# EAGLE design solenoid (EAGLE 6.6.0)
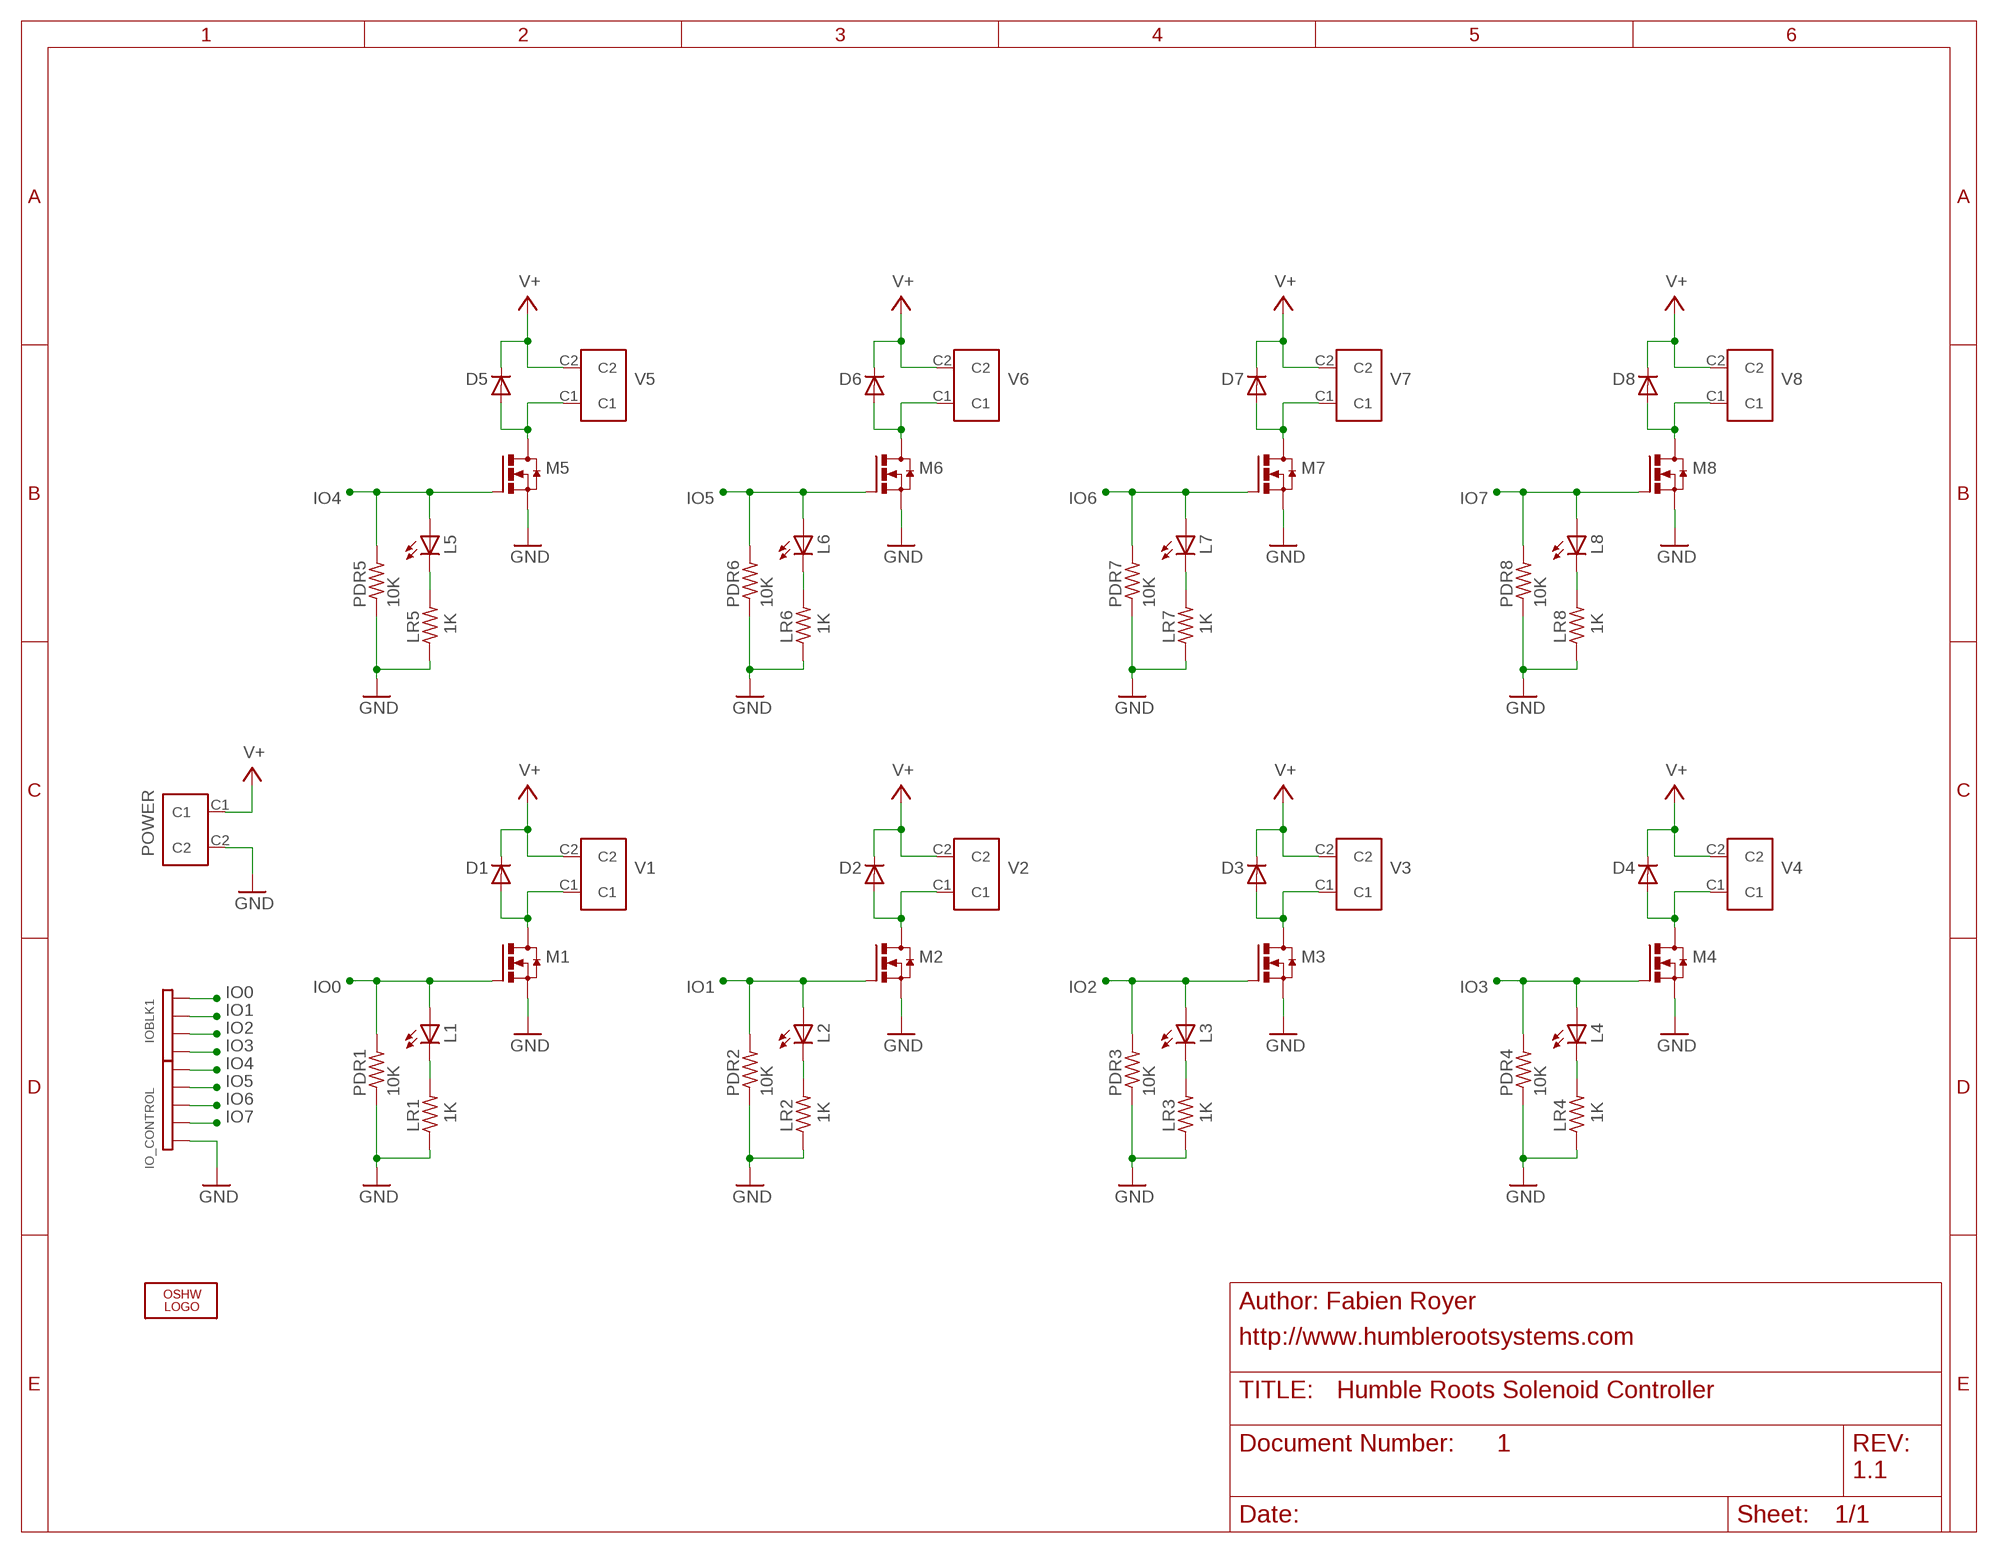
[diagram p0: schematic, sheet 1]

## Parts
D1  1N4004  [DO41-10]
D2  1N4004  [DO41-10]
D3  1N4004  [DO41-10]
D4  1N4004  [DO41-10]
D5  1N4004  [DO41-10]
D6  1N4004  [DO41-10]
D7  1N4004  [DO41-10]
D8  1N4004  [DO41-10]
IO_CONTROL  PIN_HEADER_5_POSITIONS  [PIN_HEADER_5_POSITIONS]
IOBLK1  PIN_HEADER_4_POSITIONS  [PIN_HEADER_4_POSITIONS]
L1  2v 12mA  LED3MM  [LED3MM]
L2  2v 12mA  LED3MM  [LED3MM]
L3  2v 12mA  LED3MM  [LED3MM]
L4  2v 12mA  LED3MM  [LED3MM]
L5  2v 12mA  LED3MM  [LED3MM]
L6  2v 12mA  LED3MM  [LED3MM]
L7  2v 12mA  LED3MM  [LED3MM]
L8  2v 12mA  LED3MM  [LED3MM]
LOGO1  OSHW_LOGO_6MILX0200-NT  [OSHW_6X200_NOTEXT]
LR1  1K  R-US_0207/10  [0207/10]
LR2  1K  R-US_0207/10  [0207/10]
LR3  1K  R-US_0207/10  [0207/10]
LR4  1K  R-US_0207/10  [0207/10]
LR5  1K  R-US_0207/10  [0207/10]
LR6  1K  R-US_0207/10  [0207/10]
LR7  1K  R-US_0207/10  [0207/10]
LR8  1K  R-US_0207/10  [0207/10]
M1  INTERNATIONAL_RECTIFIER_IRLB8721PBF  [TO220ABS]
M2  INTERNATIONAL_RECTIFIER_IRLB8721PBF  [TO220ABS]
M3  INTERNATIONAL_RECTIFIER_IRLB8721PBF  [TO220ABS]
M4  INTERNATIONAL_RECTIFIER_IRLB8721PBF  [TO220ABS]
M5  INTERNATIONAL_RECTIFIER_IRLB8721PBF  [TO220ABS]
M6  INTERNATIONAL_RECTIFIER_IRLB8721PBF  [TO220ABS]
M7  INTERNATIONAL_RECTIFIER_IRLB8721PBF  [TO220ABS]
M8  INTERNATIONAL_RECTIFIER_IRLB8721PBF  [TO220ABS]
PDR1  10K  R-US_0207/10  [0207/10]
PDR2  10K  R-US_0207/10  [0207/10]
PDR3  10K  R-US_0207/10  [0207/10]
PDR4  10K  R-US_0207/10  [0207/10]
PDR5  10K  R-US_0207/10  [0207/10]
PDR6  10K  R-US_0207/10  [0207/10]
PDR7  10K  R-US_0207/10  [0207/10]
PDR8  10K  R-US_0207/10  [0207/10]
POWER  PHOENIX_WIRE_CONTACT_2_POSITIONS_GENERIC  [PHOENIX_WIRE_CONTACT_2_POSITIONS_GENERIC]
V1  PHOENIX_WIRE_CONTACT_2_POSITIONS_GENERIC  [PHOENIX_WIRE_CONTACT_2_POSITIONS_GENERIC]
V2  PHOENIX_WIRE_CONTACT_2_POSITIONS_GENERIC  [PHOENIX_WIRE_CONTACT_2_POSITIONS_GENERIC]
V3  PHOENIX_WIRE_CONTACT_2_POSITIONS_GENERIC  [PHOENIX_WIRE_CONTACT_2_POSITIONS_GENERIC]
V4  PHOENIX_WIRE_CONTACT_2_POSITIONS_GENERIC  [PHOENIX_WIRE_CONTACT_2_POSITIONS_GENERIC]
V5  PHOENIX_WIRE_CONTACT_2_POSITIONS_GENERIC  [PHOENIX_WIRE_CONTACT_2_POSITIONS_GENERIC]
V6  PHOENIX_WIRE_CONTACT_2_POSITIONS_GENERIC  [PHOENIX_WIRE_CONTACT_2_POSITIONS_GENERIC]
V7  PHOENIX_WIRE_CONTACT_2_POSITIONS_GENERIC  [PHOENIX_WIRE_CONTACT_2_POSITIONS_GENERIC]
V8  PHOENIX_WIRE_CONTACT_2_POSITIONS_GENERIC  [PHOENIX_WIRE_CONTACT_2_POSITIONS_GENERIC]

## Nets
GND: IO_CONTROL.5 LR1.1 LR2.1 LR3.1 LR4.1 LR5.1 LR6.1 LR7.1 LR8.1 M1.3(SOURCE) M2.3(SOURCE) M3.3(SOURCE) M4.3(SOURCE) M5.3(SOURCE) M6.3(SOURCE) M7.3(SOURCE) M8.3(SOURCE) PDR1.1 PDR2.1 PDR3.1 PDR4.1 PDR5.1 PDR6.1 PDR7.1 PDR8.1 POWER.C2
IO0: IOBLK1.1 L1.A M1.1(GATE) PDR1.2
IO1: IOBLK1.2 L2.A M2.1(GATE) PDR2.2
IO2: IOBLK1.3 L3.A M3.1(GATE) PDR3.2
IO3: IOBLK1.4 L4.A M4.1(GATE) PDR4.2
IO4: IO_CONTROL.1 L5.A M5.1(GATE) PDR5.2
IO5: IO_CONTROL.2 L6.A M6.1(GATE) PDR6.2
IO6: IO_CONTROL.3 L7.A M7.1(GATE) PDR7.2
IO7: IO_CONTROL.4 L8.A M8.1(GATE) PDR8.2
N$1: L1.K(C) LR1.2
N$2: L2.K(C) LR2.2
N$3: D2.A M2.2(DRAIN) V2.C1
N$4: L3.K(C) LR3.2
N$5: D1.A M1.2(DRAIN) V1.C1
N$6: D3.A M3.2(DRAIN) V3.C1
N$7: L4.K(C) LR4.2
N$8: D4.A M4.2(DRAIN) V4.C1
N$9: L5.K(C) LR5.2
N$10: D5.A M5.2(DRAIN) V5.C1
N$11: L6.K(C) LR6.2
N$12: D6.A M6.2(DRAIN) V6.C1
N$13: L7.K(C) LR7.2
N$14: D7.A M7.2(DRAIN) V7.C1
N$15: L8.K(C) LR8.2
N$16: D8.A M8.2(DRAIN) V8.C1
V+: D1.C D2.C D3.C D4.C D5.C D6.C D7.C D8.C POWER.C1 V1.C2 V2.C2 V3.C2 V4.C2 V5.C2 V6.C2 V7.C2 V8.C2

## Notes on the sheet
- Author: Fabien Royer
- http://www.humblerootsystems.com
- Humble Roots Solenoid Controller
- 1
- 1.1

## Library data of the parts
D1-D8 = diode:1N4004: DIODE general purpose rectifier, 1 A
IO_CONTROL = HRS:PIN_HEADER_5_POSITIONS
IOBLK1 = HRS:PIN_HEADER_4_POSITIONS
L1-L8 = led:LED: LED OSRAM: - CHIPLED LG R971, LG N971, LY N971, LG Q971, LY Q971, LO R971, LY R971 LH N974, LH R974 LS Q976, LO Q976, LY Q976 LO Q996 - Hyper CHIPLED LW Q18S LB Q993, LB Q99A, LB R99A - SideLED LS A670, LO A670, LY A670, LG A670, LP A670 LB A673, LV A673, LT A673, LW A673 LH A674 LY A675 LS A676, LA A676, LO A676, LY A676, LW A676 LS A679, LY A679, LG A679 - Hyper Micro SIDELED® LS Y876, LA Y876, LO Y876, LY Y876 LT Y87S - SmartLED LW L88C, LW L88S LB L89C, LB L89S, LG L890 LS L89K, LO L89K, LY L89K LS L896, LA L896, LO L896, LY L896 - TOPLED LS T670, LO T670, LY T670, LG T670, LP T670 LSG T670, LSP T670, LSY T670, LOP T670, LYG T670 LG T671, LOG T671, LSG T671 LB T673, LV T673, LT T673, LW T673 LH T674 LS T676, LA T676, LO T676, LY T676, LB T676, LH T676, LSB T676, LW T676 LB T67C, LV T67C, LT T67C, LS T67K, LO T67K, LY T67K, LW E67C LS E67B, LA E67B, LO E67B, LY E67B, LB E67C, LV E67C, LT E67C LW T67C LS T679, LY T679, LG T679 LS T770, LO T770, LY T770, LG T770, LP T770 LB T773, LV T773, LT T773, LW T773 LH T774 LS E675, LA E675, LY E675, LS T675 LS T776, LA T776, LO T776, LY T776, LB T776 LHGB T686 LT T68C, LB T68C - Hyper Mini TOPLED® LB M676 - Mini TOPLED Santana® LG M470 LS M47K, LO M47K, LY M47K Source: http://www.osram.convergy.de LUXEON: - LUMILED® LXK2-PW12-R00, LXK2-PW12-S00, LXK2-PW14-U00, LXK2-PW14-V00 LXK2-PM12-R00, LXK2-PM12-S00, LXK2-PM14-U00 LXK2-PE12-Q00, LXK2-PE12-R00, LXK2-PE12-S00, LXK2-PE14-T00, LXK2-PE14-U00 LXK2-PB12-K00, LXK2-PB12-L00, LXK2-PB12-M00, LXK2-PB14-N00, LXK2-PB14-P00, LXK2-PB14-Q00 LXK2-PR12-L00, LXK2-PR12-M00, LXK2-PR14-Q00, LXK2-PR14-R00 LXK2-PD12-Q00, LXK2-PD12-R00, LXK2-PD12-S00 LXK2-PH12-R00, LXK2-PH12-S00 LXK2-PL12-P00, LXK2-PL12-Q00, LXK2-PL12-R00 Source: www.luxeon.com KINGBRIGHT: KA-3528ASYC Source: www.kingbright.com
LOGO1 = ohw-logo:OSHW_LOGO_6MIL
LR1-LR8 PDR1-PDR8 = resistor:R-US_: RESISTOR, American symbol
M1-M8 = HRS:INTERNATIONAL_RECTIFIER_IRLB8721PBF
POWER V1-V8 = HRS:PHOENIX_WIRE_CONTACT_2_POSITIONS_GENERIC

## Board
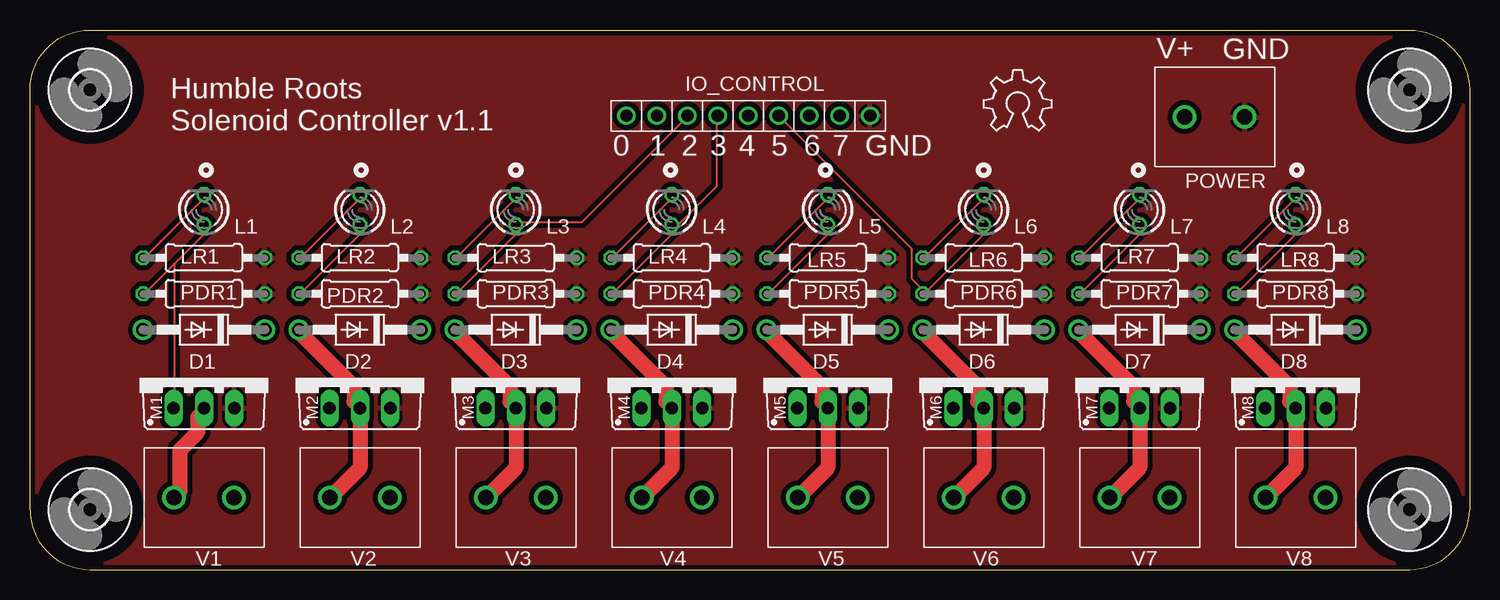
[diagram p1: board, top side]
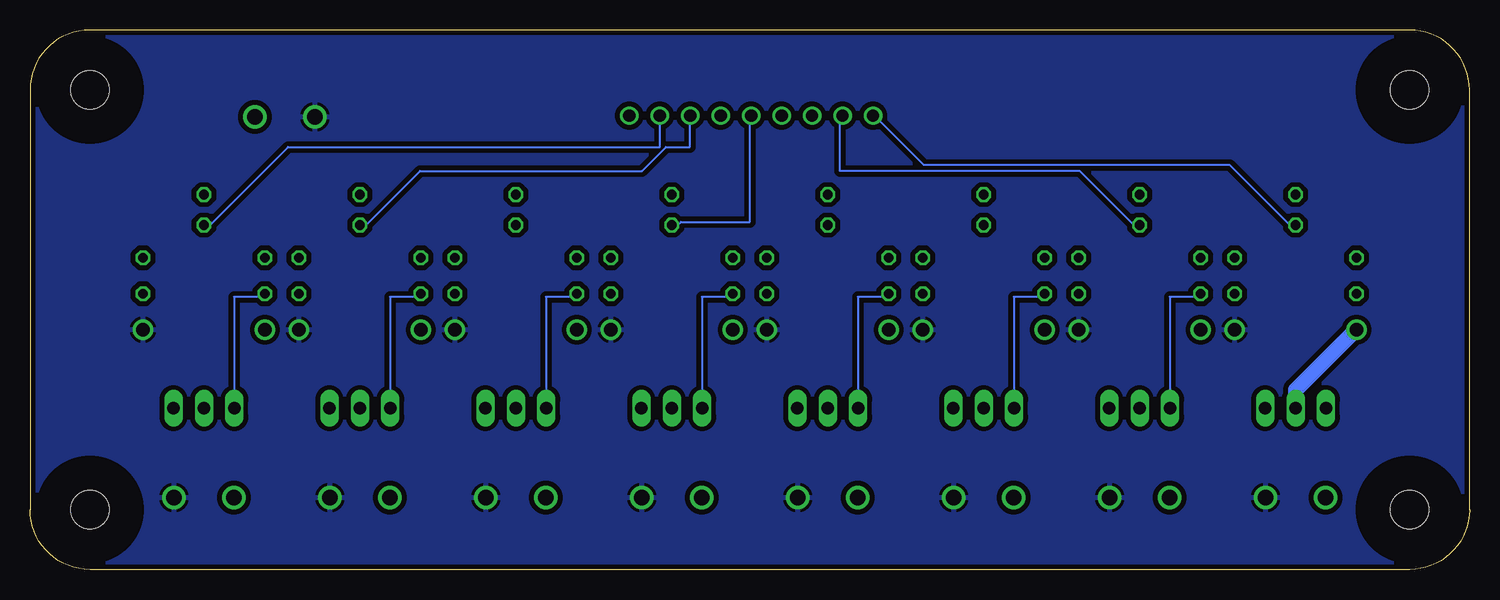
[diagram p2: board, bottom side, seen from below]

Size 120 x 45 mm. Coordinates in mm from the lower left corner, seen from the top.
Outline: 0,5 0,40 arc-90 5,45 115,45 arc-90 120,40 120,5 arc-90 115,0 5,0 arc-90 0,5
Copper layers (1*16): Top 0.0356mm / dielectric 1.5011mm / Bottom 0.0356mm
Design rules "LaenPCBOrder": minimum track width 6mil, minimum drill 13mil, track to track 6mil, track to pad 6mil, pad to pad 6mil, via to via 6mil, smd to smd 6mil, copper to edge 15mil, drill to drill 6mil, minimum pad ring 7mil, minimum via ring 7mil, stop-mask expansion 4mil, vias tented up to drill 0mil, thermal gap 10mil

### Footprints (pad centres in the part's own frame; a part is rotated, then mirrored left to right if it is on the bottom)
DO41-10 = drill 1.118: A 5.08,0; C -5.08,0
PIN_HEADER_5_POSITIONS = drill 1.016: 1 -5.08,0; 2 -2.54,0; 3 0,0; 4 2.54,0; 5 5.08,0
PIN_HEADER_4_POSITIONS = drill 1.016: 1 -3.81,0; 2 -1.27,0; 3 1.27,0; 4 3.81,0
LED3MM = drill 0.813 octagon: A -1.27,0; K 1.27,0
0207/10 = drill 0.813 octagon: 1 -5.08,0; 2 5.08,0
TO220ABS = drill 1.016 long: 1 -2.54,-2.54; 2 0,-2.54; 3 2.54,-2.54
PHOENIX_WIRE_CONTACT_2_POSITIONS_GENERIC = drill 1.3: C1 -5,0; C2 0,0
3,2 = hole 3.2: 0,0

### Placement (x,y rotation side)
D1  14.5,20 180 top
D2  27.5,20 180 top
D3  40.5,20 180 top
D4  53.5,20 180 top
D5  66.5,20 180 top
D6  79.5,20 180 top
D7  92.5,20 180 top
D8  105.5,20 180 top
IO_CONTROL  64.96,37.85 0 top
IOBLK1  53.53,37.85 0 top
L1  14.5,30 90 top
L2  27.5,30 90 top
L3  40.5,30 90 top
L4  53.5,30 90 top
L5  66.5,30 90 top
L6  79.5,30 90 top
L7  92.5,30 90 top
L8  105.5,30 90 top
LOGO1  79.5,36.6 0 top
LR1  14.5,26 180 top
LR2  27.5,26 180 top
LR3  40.5,26 180 top
LR4  53.5,26 180 top
LR5  66.5,26 180 top
LR6  79.5,26 180 top
LR7  92.5,26 180 top
LR8  105.5,26 180 top
M1  14.5,16 0 top
M2  27.5,16 0 top
M3  40.5,16 0 top
M4  53.5,16 0 top
M5  66.5,16 0 top
M6  79.5,16 0 top
M7  92.5,16 0 top
M8  105.5,16 0 top
PDR1  14.5,23 180 top
PDR2  27.5,23 180 top
PDR3  40.5,23 180 top
PDR4  53.5,23 180 top
PDR5  66.5,23 180 top
PDR6  79.5,23 180 top
PDR7  92.5,23 180 top
PDR8  105.5,23 180 top
POWER  101.25,37.75 0 top
U$1  [3,2]  115,5 0 top
U$2  [3,2]  115,40 0 top
U$3  [3,2]  5,5 0 top
U$4  [3,2]  5,40 0 top
V1  17,6 0 top
V2  30,6 0 top
V3  43,6 0 top
V4  56,6 0 top
V5  69,6 0 top
V6  82,6 0 top
V7  95,6 0 top
V8  108,6 0 top

### Tracks (layer width: path | path; a pad name or v marks a point on that pad's centre or on a via)
GND
  pour Top (isolate 0.406): 5.1,45 114.9,45 115,45 arc-90 120,40 120,5.1 120,5 arc-90 115,0 5.1,0 5,0 arc-90 0,5 0,39.9 0,40 arc-90 5,45
IO0
  Top 0.152: 12,25.5 14.5,28 L1.A | 12,25.5 9.5,23 PDR1.2 | 12,25.5 12,13.5 M1.1
  Bottom 0.152: IOBLK1.1 49.5,37.75 45.5,33.75 20,33.75 15,28.75 14.5,28.75 L1.A
IO1
  Top 0.152: L2.A 27.5,28 22.5,23 PDR2.2
  Bottom 0.152: M2.1 25,13.5 25,22.75 22.75,22.75 22.5,23 PDR2.2 | IOBLK1.2 52.5,37.75 52.5,33.25 32.5,33.25 28,28.75 27.5,28.75 L2.A
IO2
  Top 0.152: PDR3.2 35.5,23 40.5,28 L3.A 40.5,29 46,29 54.75,37.75 IOBLK1.3
  Bottom 0.152: M3.1 38,13.5 38,22.75 35.75,22.75 35.5,23 PDR3.2
IO3
  Top 0.152: 53.5,28.25 L4.A 53.5,28.5 | 53.5,28.25 53.5,28 48.5,23 PDR4.2 | 53.5,28.25 57.25,32 57.25,37.75 IOBLK1.4
  Bottom 0.152: M4.1 51,13.5 51,22.75 48.75,22.75 48.5,23 PDR4.2
IO4
  Top 0.152: L5.A 66.5,28 61.5,23 PDR5.2
  Bottom 0.152: M5.1 64,13.5 64,22.75 61.75,22.75 61.5,23 PDR5.2 | IO_CONTROL.1 60,37.75 60,29 65.75,29 66,28.75 66.5,28.75 L5.A
IO5
  Top 0.152: L6.A 79.5,28 74.5,23 PDR6.2 74.25,23 74.25,23.5 73.5,24.25 73.5,26.75 62.5,37.75 IO_CONTROL.2
  Bottom 0.152: M6.1 77,13.5 77,22.75 74.75,22.75 74.5,23 PDR6.2
IO6
  Top 0.152: L7.A 92.5,28 87.5,23 PDR7.2
  Bottom 0.152: IO_CONTROL.3 65,37.75 65,35.25 67,35.25 69,33.25 87.5,33.25 92,28.75 92.5,28.75 L7.A | M7.1 90,13.5 90,22.75 87.75,22.75 87.5,23 PDR7.2
IO7
  Top 0.152: L8.A 105.5,28 100.5,23 PDR8.2
  Bottom 0.152: IO_CONTROL.4 67.5,35.25 98.5,35.25 105,28.75 105.5,28.75 L8.A | M8.1 103,13.5 103,22.75 100.75,22.75 100.5,23 PDR8.2
N$1
  Top 0.152: L1.K 14.5,31 9.5,26 LR1.2
N$2
  Top 0.152: L2.K 27.5,31 22.5,26 LR2.2
N$3
  Top 0.152: 27,14 27.5,13.5 M2.2 | 22.5,19.75 22.5,20 D2.A
  Top 1.27: 27,14 27,15.25 22.5,19.75 | V2.C1 27.5,8.5 M2.2
N$4
  Top 0.152: L3.K 40.5,31 35.5,26 LR3.2
N$5
  Top 0.152: V1.C1 12.5,6.5 | 14.5,13.25 M1.2
  Top 1.27: 14.5,13.25 14,12.75 14,11.5 12.5,10 12.5,6.5
  Bottom 0.152: 9.5,20 D1.A
  Bottom 1.27: 9.5,20 14.5,15 M1.2
N$6
  Top 0.152: 40,14 40.5,13.5 M3.2 | 35.5,19.75 35.5,20 D3.A
  Top 1.27: 40,14 40,15.25 35.5,19.75 | V3.C1 40.5,8.5 M3.2
N$7
  Top 0.152: L4.K 53.5,31 48.5,26 LR4.2
N$8
  Top 0.152: 53,14 53.5,13.5 M4.2 | 48.5,19.75 48.5,20 D4.A
  Top 1.27: 53,14 53,15.25 48.5,19.75 | V4.C1 53.5,8.5 M4.2
N$9
  Top 0.152: L5.K 66.5,31 61.5,26 LR5.2
N$10
  Top 0.152: 66,14 66.5,13.5 M5.2 | 61.5,19.75 61.5,20 D5.A
  Top 1.27: 66,14 66,15.25 61.5,19.75 | V5.C1 66.5,8.5 M5.2
N$11
  Top 0.152: L6.K 79.5,31 74.5,26 LR6.2
N$12
  Top 0.152: 79,14 79.5,13.5 M6.2 | 74.5,19.75 74.5,20 D6.A
  Top 1.27: 79,14 79,15.25 74.5,19.75 | V6.C1 79.5,8.5 M6.2
N$13
  Top 0.152: L7.K 92.5,31 87.5,26 LR7.2
N$14
  Top 0.152: 92,14 92.5,13.5 M7.2 | 87.5,19.75 87.5,20 D7.A
  Top 1.27: 92,14 92,15.25 87.5,19.75 | V7.C1 92.5,8.5 M7.2
N$15
  Top 0.152: L8.K 105.5,31 100.5,26 LR8.2
N$16
  Top 0.152: 105,14 105.5,13.5 M8.2 | 100.5,19.75 100.5,20 D8.A
  Top 1.27: 105,14 105,15.25 100.5,19.75 | V8.C1 105.5,8.5 M8.2
V+
  pour Bottom (isolate 0.406): 5.1,45 115,45 arc-90 120,40 120,5.1 120,5 arc-90 115,0 5.1,0 5,0 arc-90 0,5 0,39.9 0,40 arc-90 5,45

### Text on the board
_tsilk: V+ | GND | Humble Roots / Solenoid Controller v1.1 | 0 | 1 | 2 | 3 | 4 | 5 | 6 | 7 | GND